# Altium schematic sheet CLOCK.SchDoc
size A4; SheetNumber: 2; SheetTotal: 8
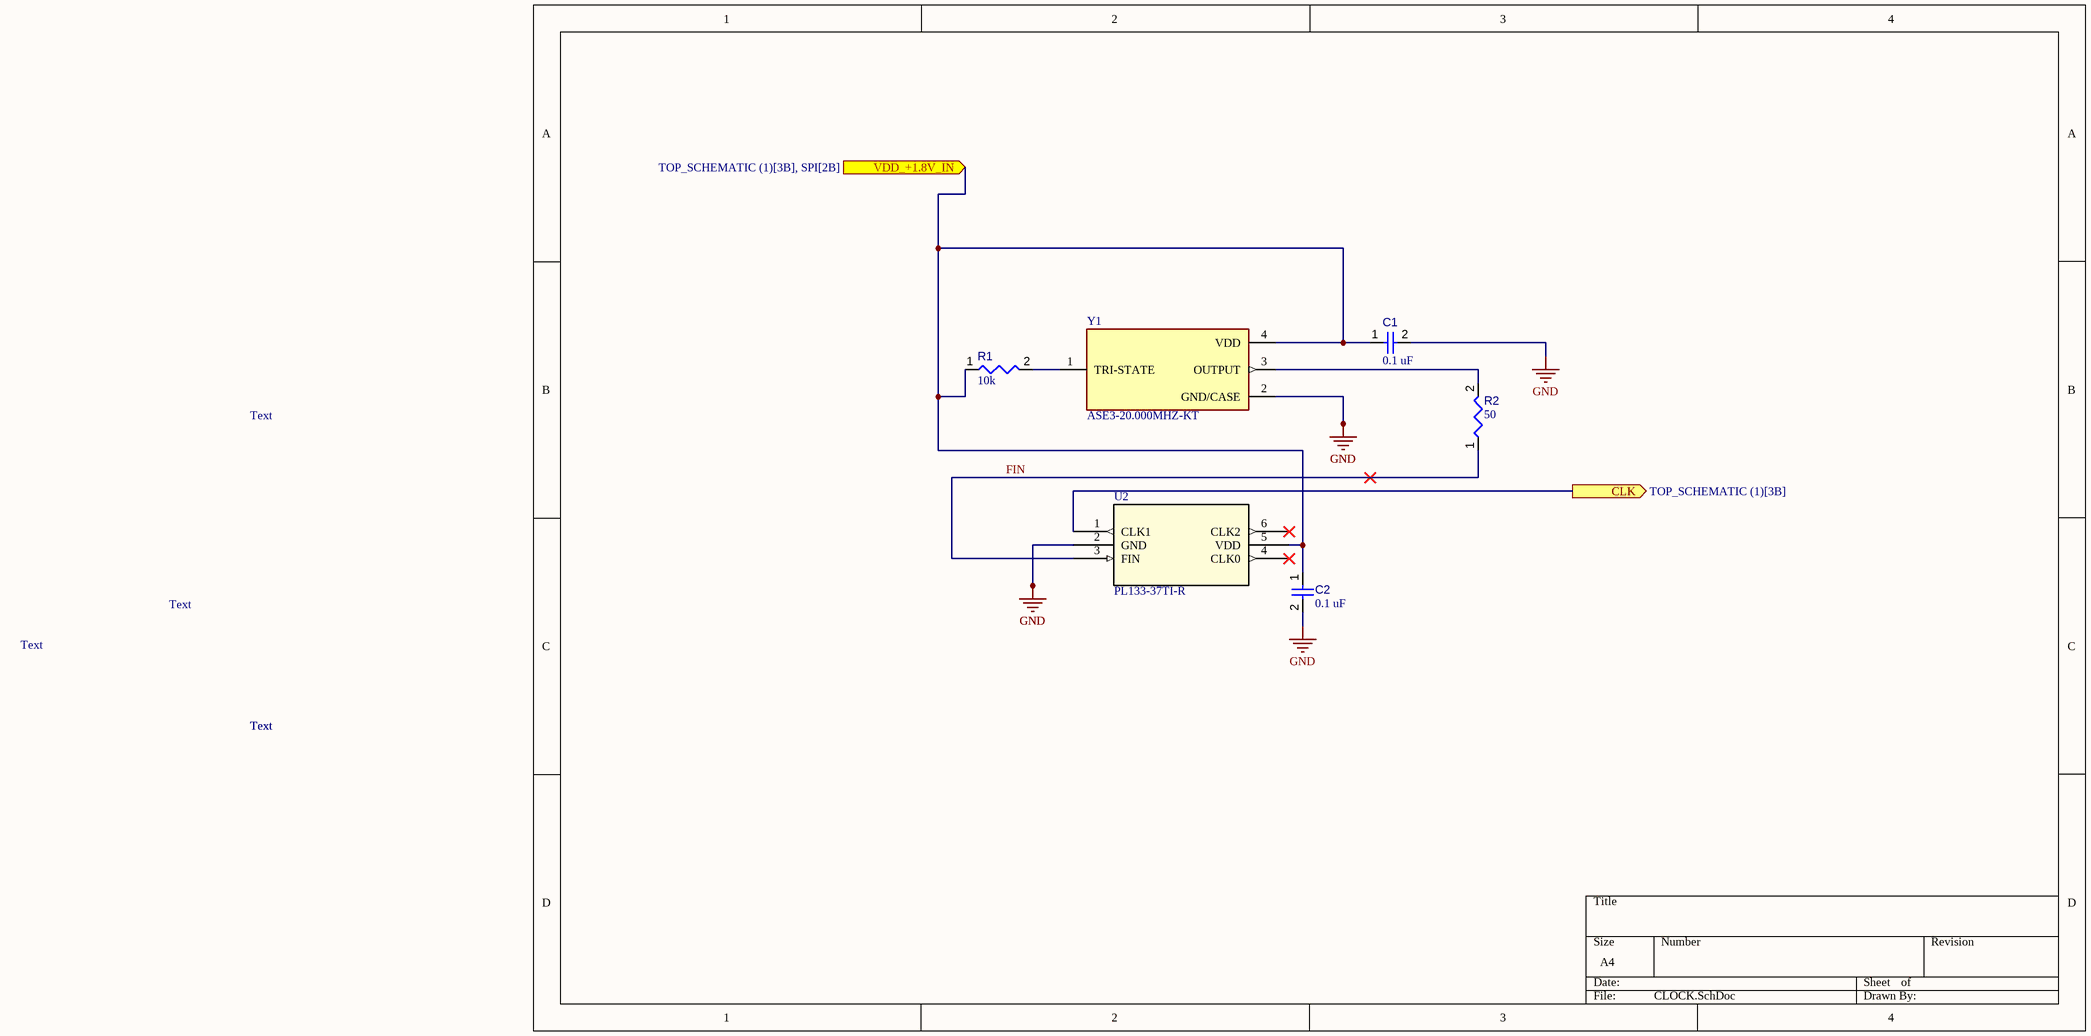
[diagram p0: CLOCK.SchDoc]

## Parts
C1  value 0.1 uF  [CAPC1608X90X40ML10T20]  (hidden comment: Capacitor 0.1 uF)
C2  value 0.1 uF  [CAPC1608X90X40ML10T20]  (hidden comment: Capacitor 0.1 uF)
R1  value 10k  [RESC2013X50X35ML15T15]  (hidden comment: Resistor 10k +/-1% 0805 125 mW)
R2  value 50  [RESC1608X55X25ML10T15]  (hidden comment: Resistor 50 +/-1% 0603 100 mW)
U2  PL133-37TI-R  [SOT-23-6_MC_MCH]
Y1  ASE3-20.000MHZ-KT  [XTAL_ASE3-20.000MHZ-KT]

## Ports
CLK (out, see TOP_SCHEMATIC (1)[3B]), VDD_+1.8V_IN (in, see TOP_SCHEMATIC (1)[3B], SPI[2B])

## Nets
GND: C1.2 C2.2 U2.2(GND) Y1.2(GND/CASE)
CLK: U2.1(CLK1) ; port CLK
FIN: R2.1 U2.3(FIN)
VDD_+1.8V_IN: C1.1 C2.1 R1.1 U2.5(VDD) Y1.4(VDD) ; port VDD_+1.8V_IN
NetR1_2: R1.2 Y1.1(TRI-STATE)
NetR2_2: R2.2 Y1.3(OUTPUT)

Not connected (* = marked no-connect by the designer): U2 4(CLK0)* 6(CLK2)*

## Notes on the sheet
- Text

## Library data of the parts
C1 C2 = CMP-001-00014-6: Chip Capacitor, 0.1 uF 0603; Capacitor Type: Ceramic; Tolerance: 5%; Voltage Rating: 50V; RoHS Compliant: True; Case/Package: 0603; Max Operating Temperature: 125°C; Pins: 2; Mounting Technology: SM; Min Operating Temperature: -55°C
R1 = CMP-009-00018-5: Chip Resistor, 10 KOhm, +/- 1%, 125 mW, -55 to 155 degC, 0805 (2012 Metric); Power: 125mW; Voltage Rating: 150V; Tolerance: 1%; Pins: 2; Min Operating Temperature: -55°C; Case/Package: 0805; Max Operating Temperature: 155°C; RoHS Compliant: True; Mounting Technology: SM
R2 = CMP-009-00017-5: Chip Resistor, 50 Ohm 0603; Voltage Rating: 50V; Power: 100mW; Tolerance: 1%; RoHS Compliant: True; Min Operating Temperature: -55°C; Pins: 2; Case/Package: 0603; Mounting Technology: SM; Max Operating Temperature: 155°C
U2 = PL133-37TI-R: Description; Manufacturer_Name: Microchip; Copyright: Copyright (C) 2025 Ultra Librarian. All rights reserved.; Manufacturer_Part_Number: PL133-37TI-R; RefDes: RefDes; Type: Type
Y1 = ASE3-20.000MHZ-KT: Price: None; MP: ASE3-20.000MHZ-KT; Availability: Unavailable; Value: *; Package: None